# Altium schematic sheet Main Power.SchDoc
size A4
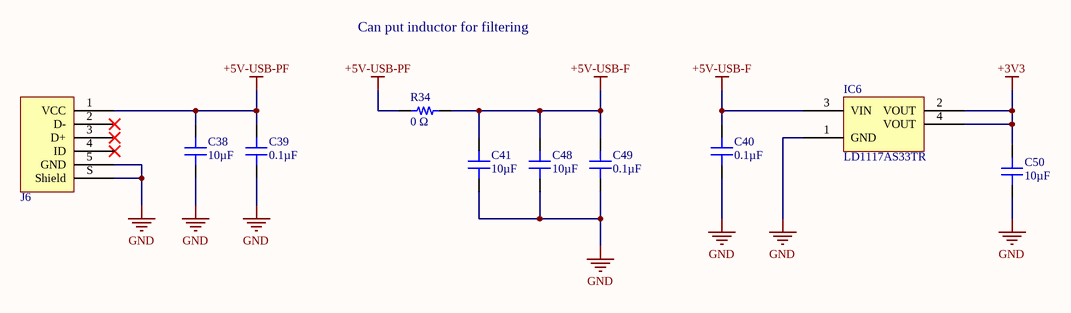
[diagram p0: Main Power.SchDoc]

## Parts
C38  10µF  [CAP 0805_2012]
C39  0.1µF  [CAP 0402_1005]
C40  0.1µF  [CAP 0402_1005]
C41  10µF  [CAP 0805_2012]
C48  10µF  [CAP 0805_2012]
C49  0.1µF  [CAP 0402_1005]
C50  10µF  [CAP 0805_2012]
IC6  LD1117AS33TR  [ST SOT-223]
J6  10118193-0001LF  [FCI USB 10118193-0001LF]  (value not drawn)
R34  0 Ω  [RES 0805_2012]

## Nets
+3V3: C50.2 IC6.2(VOUT) IC6.4(VOUT)
+5V-USB-F: C40.2 C41.2 C48.2 C49.2 IC6.3(VIN) R34.1
+5V-USB-PF: C38.2 C39.2 J6.1(VCC) R34.2
GND: C38.1 C39.1 C40.1 C41.1 C48.1 C49.1 C50.1 IC6.1(GND) J6.5(GND) J6.S(Shield)

Not connected (* = marked no-connect by the designer): J6 2(D-)* 3(D+)* 4(ID)*

## Notes on the sheet
- Can put inductor for filtering

## Library data of the parts
C38 C41 C48 C50 = 08056D106KAT4A: CAP CER 10UF 6.3V X5R 0805; Manufacturer: AVX Corporation; Tolerance: ±10%; Part Number: 08056D106KAT4A; Applications: General Purpose; Capacitance: 10µF; ComponentLink1Description: Datasheet; ComponentLink1URL: http://datasheets.avx.com/cx5r.pdf; ComponentLink2Description: DigiKey Link; ComponentLink2URL: http://digikey.com/product-detail/en/avx-corporation/08056D106KAT4A/478-10692-1-ND/7536564; Device Package: 0805 (2012 Metric); LastUpdated: 2020-02-03 5:06:37 PM; Lifecycle Status: Active; Minimum Order: 1; Mounting Type: Surface Mount, MLCC; Operating Temperature: -55°C ~ 85°C; Package / Case: 0805 (2012 Metric); Packaging: TapeAndReel; Part Status: Active; Price: 0.17; Series: -; Size / Dimension: 0.079" L x 0.049" W (2.01mm x 1.25mm); Supplier 1: DigiKey; Supplier Part Number 1: 478-10692-1-ND; Temperature Coefficient: X5R; Thickness (Max): 0.060" (1.52mm); Value: 10µF; Voltage - Rated: 6.3V
C39 C40 C49 = 0402B104K6R3CT: CAP CER 0.1UF 6.3V X7R 0402; Manufacturer: Walsin Technology Corporation; Tolerance: ±10%; Part Number: 0402B104K6R3CT; Applications: General Purpose; Capacitance: 0.1µF; ComponentLink1Description: Datasheet; ComponentLink1URL: http://www.passivecomponent.com/wp-content/uploads/2018/10/MLCC.pdf; ComponentLink2Description: DigiKey Link; ComponentLink2URL: http://digikey.com/product-detail/en/walsin-technology-corporation/0402B104K6R3CT/1292-1177-1-ND/9355181; Device Package: 0402 (1005 Metric); LastUpdated: 2020-02-03 5:04:43 PM; Lifecycle Status: Active; Minimum Order: 1; Mounting Type: Surface Mount, MLCC; Operating Temperature: -55°C ~ 125°C; Package / Case: 0402 (1005 Metric); Packaging: CutTape; Part Status: Active; Price: 0.10; Series: -; Size / Dimension: 0.039" L x 0.020" W (1.00mm x 0.50mm); Supplier 1: DigiKey; Supplier Part Number 1: 1292-1177-1-ND; Temperature Coefficient: X7R; Thickness (Max): 0.022" (0.55mm); Value: 0.1µF; Voltage - Rated: 6.3V
IC6 = LD1117AS33TR: IC REG LINEAR 3.3V 1A SOT223; Manufacturer: STMicroelectronics; Current - Quiescent (Iq): 10mA; Number of Regulators: 1; Output Configuration: Positive; Output Type: Fixed; Protection Features: Over Current, Over Temperature; PSRR: 75dB (120Hz); Voltage Dropout (Max): 1.3V @ 1A; Voltage - Input (Max): 15V; Part Number: LD1117AS33TR; ComponentLink1Description: Datasheet; ComponentLink1URL: http://www.st.com/content/ccc/resource/technical/document/datasheet/a5/c3/3f/c9/2b/15/40/49/CD00002116.pdf/files/CD00002116.pdf/jcr:content/translations/en.CD00002116.pdf; ComponentLink2Description: DigiKey Link; ComponentLink2URL: http://digikey.com/product-detail/en/stmicroelectronics/LD1117AS33TR/497-1228-1-ND/586228; Current - Output: 1A; Device Package: TO-261-4, TO-261AA; LastUpdated: 2020-02-03 5:34:57 PM; Lifecycle Status: Active; Minimum Order: 1; Mounting Type: Surface Mount; Operating Temperature: 0°C ~ 125°C; Package / Case: TO-261-4, TO-261AA; Packaging: TapeAndReel; Part Status: Active; Price: 0.26; Series: -; Supplier 1: DigiKey; Supplier Part Number 1: 497-1228-1-ND; Supplier Device Package: SOT-223; Voltage - Output (Min/Fixed): 3.3V
J6 = 10118193-0001LF: CONN RCPT USB2.0 MICRO B SMD R/A; Manufacturer: Amphenol ICC (FCI); Connector Type: USB - micro B; Current Rating (Amps): 1.8A per Contact; Gender: Receptacle; Mating Cycles: 10000; Number of Contacts: 5; Number of Ports: 1; Shielding: Shielded; Voltage - Rated: 100VAC; Part Number: 10118193-0001LF; ComponentLink1Description: Datasheet; ComponentLink1URL: https://cdn.amphenol-icc.com/media/wysiwyg/files/documentation/datasheet/inputoutput/io_usb_micro.pdf; ComponentLink2Description: DigiKey Link; ComponentLink2URL: //digikey.com/product-detail/en/amphenol-icc-fci/10118193-0001LF/609-4616-2-ND/2785388; Features: Solder Retention; LastUpdated: 2020-02-03 5:11:45 PM; Lifecycle Status: 0; Minimum Order: 1; Mounting Feature: Horizontal; Mounting Type: Surface Mount, Right Angle; Through Hole; Operating Temperature: -30°C ~ 80°C; Packaging: TapeAndReel; Part Status: Active; Price: 0.21; Series: -; Specifications: USB 2.0; Supplier 1: DigiKey; Supplier Part Number 1: 609-4616-2-ND; Termination: Solder
R34 = CR0805AJ/-000EAS: RESA-AS 0805 0R JUMPER 125MW; Manufacturer: Bourns Inc.; Power (Watts): 0.125W, 1/8W; Value: 0 Ohms; Part Number: CR0805AJ/-000EAS; ComponentLink1Description: Datasheet; ComponentLink1URL: //media.digikey.com/pdf/Data%20Sheets/Bourns%20PDFs/CRyyyyA-AS_Model_DS.pdf; ComponentLink2Description: DigiKey Link; ComponentLink2URL: http://digikey.com/product-detail/en/bourns-inc/CR0805AJ-000EAS/CR0805AJ-000EASCT-ND/10240183; Composition: Thick Film; Device Package: 0805 (2012 Metric); Features: Anti-Sulfur, Automotive AEC-Q200, Moisture Resistant; Height - Seated (Max): 0.024" (0.60mm); LastUpdated: 2020-02-19 6:28:07 AM; Lifecycle Status: Active; Minimum Order: 1; Number of Terminations: 2; Operating Temperature: -55°C ~ 155°C; Package / Case: 0805 (2012 Metric); Packaging: TapeAndReel; Part Status: Active; Price: 0.01; Ratings: AEC-Q200; Resistance: 0 Ω; Series: CR0805A-AS; Size / Dimension: 0.079" L x 0.049" W (2.00mm x 1.25mm); Supplier 1: DigiKey; Supplier Part Number 1: CR0805AJ/-000EASCT-ND; Supplier Device Package: 0805; Tolerance: Jumper